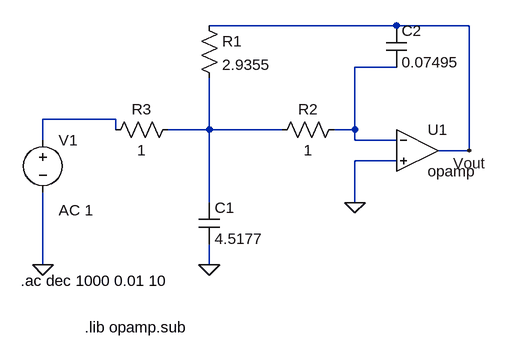
[diagram p0: schematic Tarea_2_MFB.asc]
Tarea_2_MFB.asc, the LTspice schematic file:
Version 4
SHEET 1 880 680
WIRE 224 -48 -64 -48
WIRE 336 -48 224 -48
WIRE 224 16 160 16
WIRE -208 96 -320 96
WIRE -208 112 -208 96
WIRE -64 112 -64 32
WIRE -64 112 -128 112
WIRE 48 112 -64 112
WIRE 160 112 160 16
WIRE 160 112 128 112
WIRE -320 128 -320 96
WIRE 160 128 160 112
WIRE 224 128 160 128
WIRE 336 144 336 -48
WIRE 336 144 288 144
WIRE 224 160 160 160
WIRE -64 224 -64 112
WIRE 160 224 160 160
WIRE -320 320 -320 208
WIRE -64 320 -64 288
FLAG 160 224 0
FLAG -64 320 0
FLAG -320 320 0
FLAG 336 144 Vout
SYMBOL res -80 -64 R0
SYMATTR InstName R1
SYMATTR Value 2.9355
SYMBOL res 144 96 R90
WINDOW 0 0 56 VBottom 2
WINDOW 3 32 56 VTop 2
SYMATTR InstName R2
SYMATTR Value 1
SYMBOL res -112 96 R90
WINDOW 0 0 56 VBottom 2
WINDOW 3 32 56 VTop 2
SYMATTR InstName R3
SYMATTR Value 1
SYMBOL cap -80 224 R0
SYMATTR InstName C1
SYMATTR Value 4.5177
SYMBOL cap 208 -48 R0
SYMATTR InstName C2
SYMATTR Value 0.07495
SYMBOL voltage -320 112 R0
WINDOW 123 24 124 Left 2
WINDOW 39 0 0 Left 0
SYMATTR InstName V1
SYMATTR Value ""
SYMATTR Value2 AC 1
SYMBOL OpAmps\\opamp 256 80 R0
SYMATTR InstName U1
TEXT -354 344 Left 2 !.ac dec 1000 0.01 10
TEXT -256 416 Left 2 !.lib opamp.sub

The netlist it stands for:
* Tarea_2_MFB.asc
R1 Vout N003 2.9355
R2 N001 N003 1
R3 N003 N002 1
C1 N003 0 4.5177
C2 Vout N001 0.07495
V1 N002 0 AC 1
XU1 N001 0 Vout opamp Aol=100K GBW=10Meg  ; pins invin noninvin out
.ac dec 1000 0.01 10
.lib opamp.sub
.backanno
.end